# EAGLE design Senior_Design_Board (EAGLE 9.6.2)
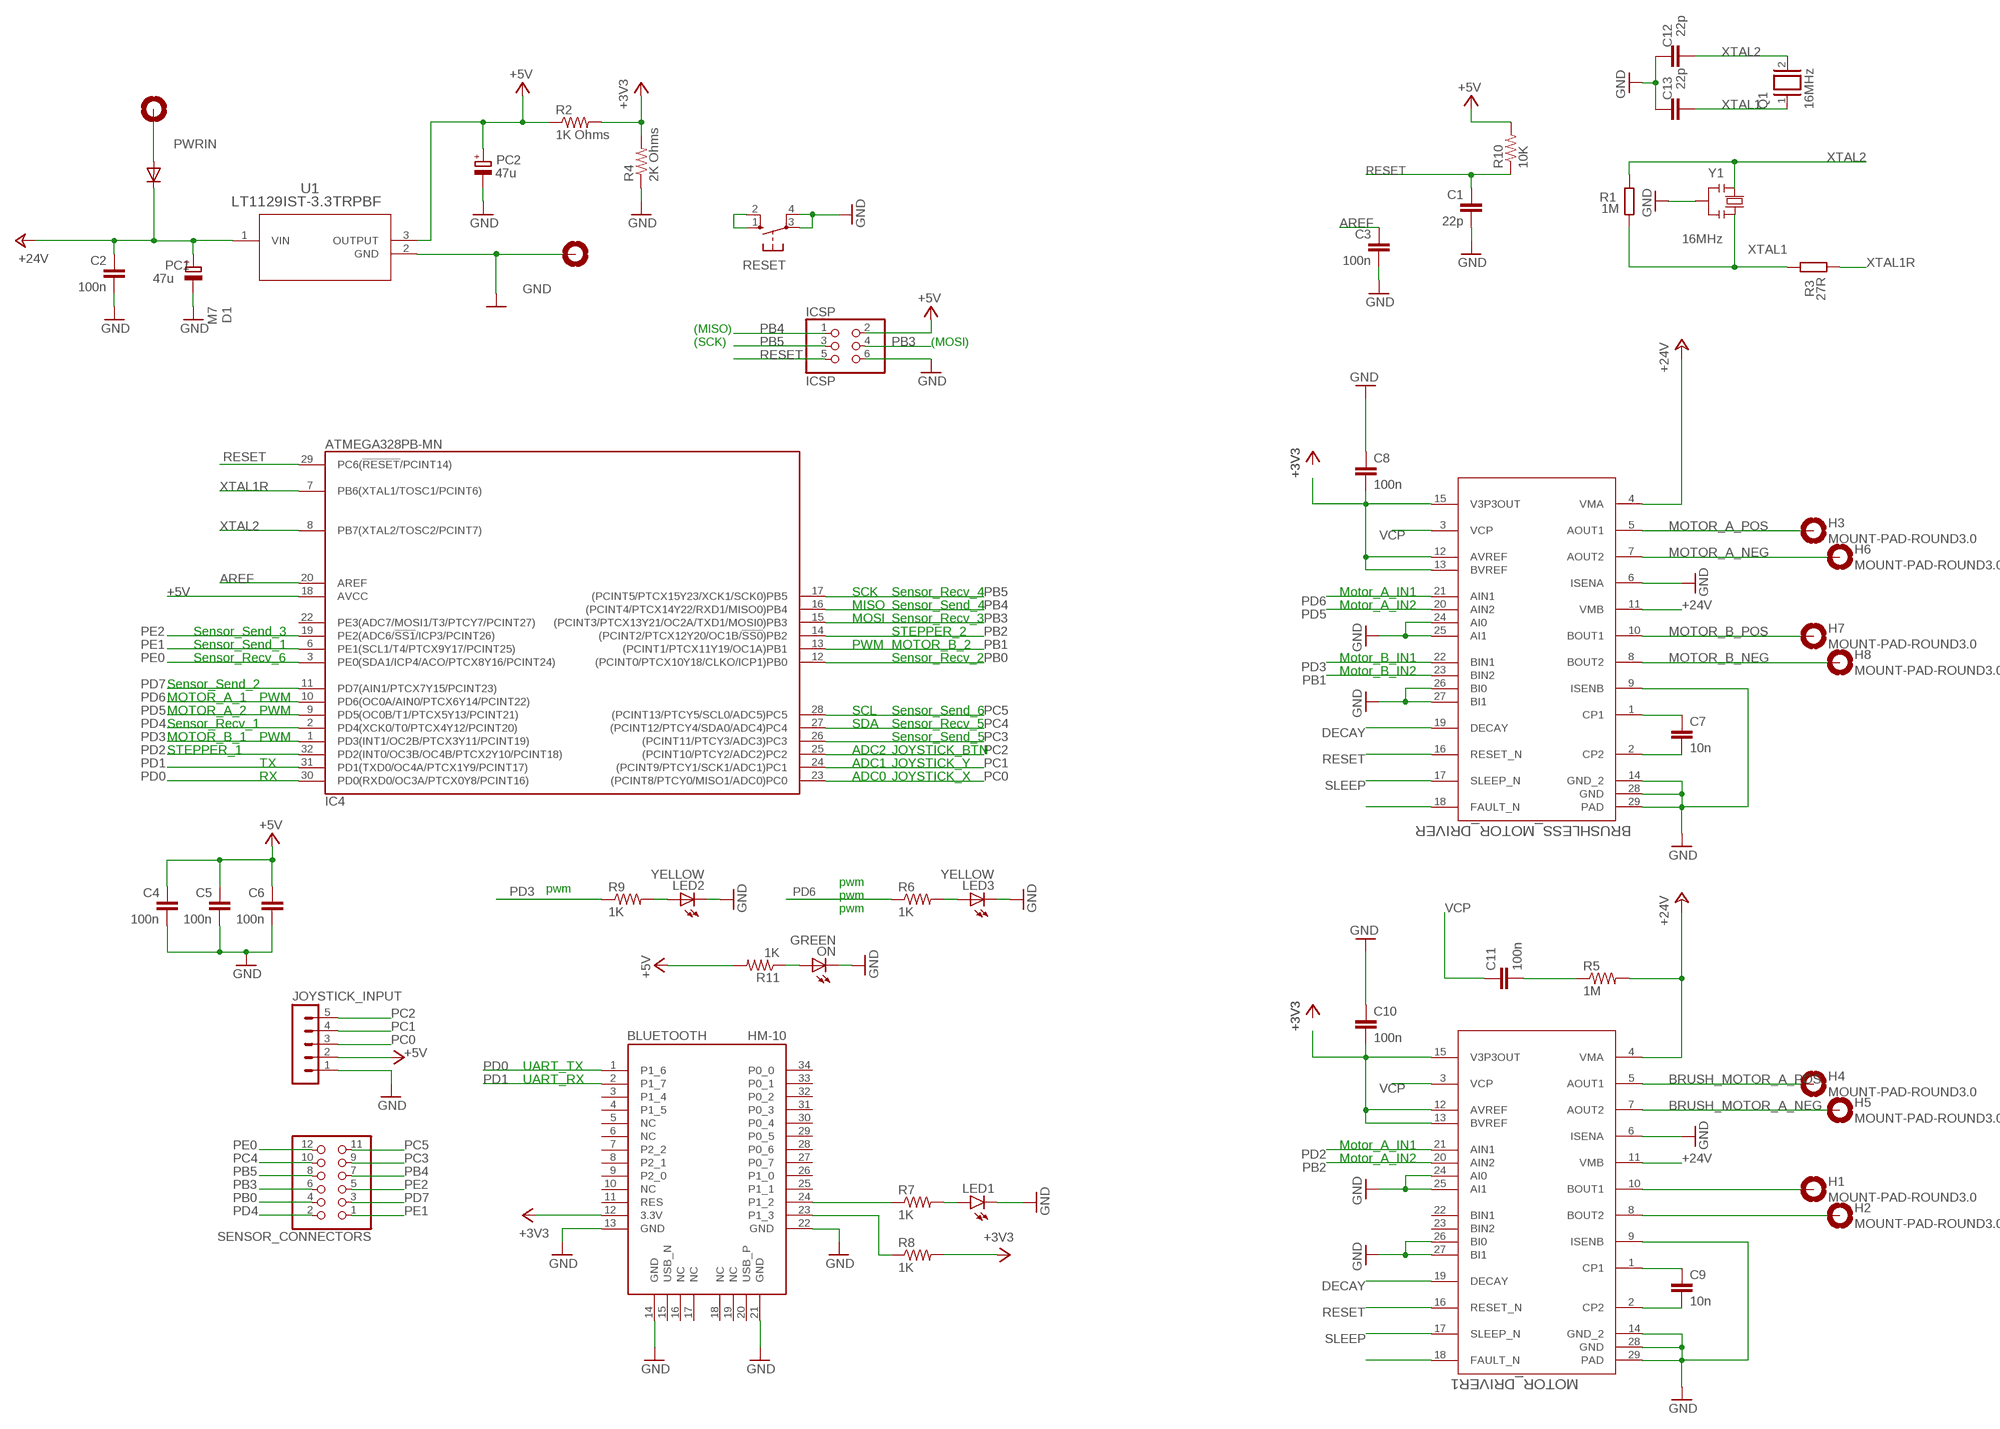
[diagram p0: schematic, sheet 1]

## Parts
BATTERY_NEG  MOUNT-PAD-ROUND3.0  [3,0-PAD]
BATTERY_POS  MOUNT-PAD-ROUND3.0  [3,0-PAD]
BLUETOOTH  HM-10  [HM-10]
BRUSHLESS_MOTOR_DRIVER  Value  DRV8841PWP  [PWP0028C_N]
C1  22p  C-EU0603-RND  [C0603-ROUND]
C2  100n  C-EU0603-RND  [C0603-ROUND]
C3  100n  C-EU0603-RND  [C0603-ROUND]
C4  100n  C-EU0603-RND  [C0603-ROUND]
C5  100n  C-EU0603-RND  [C0603-ROUND]
C6  100n  C-EU0603-RND  [C0603-ROUND]
C7  10n  C2,5-3  [C2.5-3]
C8  100n  C2,5-3  [C2.5-3]
C9  10n  C2,5-3  [C2.5-3]
C10  100n  C2,5-3  [C2.5-3]
C11  100n  C2,5-3  [C2.5-3]
C12  22p  C-EU0603-RND  [C0603-ROUND]
C13  22p  C-EU0603-RND  [C0603-ROUND]
D1  M7  DIODE-SMB  [SMB]
H1  MOUNT-PAD-ROUND3.0  [3,0-PAD]
H2  MOUNT-PAD-ROUND3.0  [3,0-PAD]
H3  MOUNT-PAD-ROUND3.0  [3,0-PAD]
H4  MOUNT-PAD-ROUND3.0  [3,0-PAD]
H5  MOUNT-PAD-ROUND3.0  [3,0-PAD]
H6  MOUNT-PAD-ROUND3.0  [3,0-PAD]
H7  MOUNT-PAD-ROUND3.0  [3,0-PAD]
H8  MOUNT-PAD-ROUND3.0  [3,0-PAD]
IC4  ATMEGA328PB-MN  [QFN32_5X5_0.50]
ICSP  ICSP  PINHD-2X3  [2X03]
JOYSTICK_INPUT  MA05-1  [MA05-1]
LED1  LEDCHIP-LED0805  [CHIP-LED0805]
LED2  YELLOW  LEDCHIP-LED0805  [CHIP-LED0805]
LED3  YELLOW  LEDCHIP-LED0805  [CHIP-LED0805]
MOTOR_DRIVER1  Value  DRV8841PWP  [PWP0028C_N]
ON  GREEN  LEDCHIP-LED0805  [CHIP-LED0805]
PC1  47u  CPOL-EUD  [PANASONIC_D]
PC2  47u  CPOL-EUD  [PANASONIC_D]
Q1  16MHz  XTAL/S  [QS]
R1  1M  R-EU_R0603  [R0603-ROUND]
R2  1K Ohms  R-US_0204/7  [0204/7]
R3  27R  R-EU_R0603  [R0603-ROUND]
R4  2K Ohms  R-US_0204/7  [0204/7]
R5  1M  R-US_0204/7  [0204/7]
R6  1K  R-US_M0805  [M0805]
R7  1K  R-US_0204/7  [0204/7]
R8  1K  R-US_0204/7  [0204/7]
R9  1K  R-US_M0805  [M0805]
R10  10K  R-US_M0805  [M0805]
R11  1K  R-US_M0805  [M0805]
RESET  10-XX  [B3F-10XX]
SENSOR_CONNECTORS  PINHD-2X6  [2X06]
U1  LT1129IST-3.3TRPBF  [SOT-223_ST_LIT]
Y1  16MHz  RESONATORMU  [RESONATOR]

## Nets
+3V3: BLUETOOTH.12(3.3V) R2.2 R4.2 R8.2
+5V: C4.1 C5.1 C6.1 IC4.18(AVCC) ICSP.2 JOYSTICK_INPUT.2 PC2.+ R2.1 R10.2 R11.2 U1.3(OUTPUT)
+24V: BRUSHLESS_MOTOR_DRIVER.4(VMA) BRUSHLESS_MOTOR_DRIVER.11(VMB) C2.1 D1.C MOTOR_DRIVER1.4(VMA) MOTOR_DRIVER1.11(VMB) PC1.+ R5.2 U1.1(VIN)
AREF: C3.1 IC4.20(AREF)
BRUSH_MOTOR_A_NEG: H5.B3,0(MOUNT) MOTOR_DRIVER1.7(AOUT2)
BRUSH_MOTOR_A_POS: H4.B3,0(MOUNT) MOTOR_DRIVER1.5(AOUT1)
DECAY: BRUSHLESS_MOTOR_DRIVER.19(DECAY) MOTOR_DRIVER1.19(DECAY)
DRIVER_FAULT: BRUSHLESS_MOTOR_DRIVER.18(FAULT_N)
DRIVER_FAULT1: MOTOR_DRIVER1.18(FAULT_N)
GND: BATTERY_POS.B3,0(MOUNT) BLUETOOTH.13(GND) BLUETOOTH.14(GND) BLUETOOTH.21(GND) BLUETOOTH.22(GND) BRUSHLESS_MOTOR_DRIVER.6(ISENA) BRUSHLESS_MOTOR_DRIVER.9(ISENB) BRUSHLESS_MOTOR_DRIVER.14(GND_2) BRUSHLESS_MOTOR_DRIVER.24(AI0) BRUSHLESS_MOTOR_DRIVER.25(AI1) BRUSHLESS_MOTOR_DRIVER.26(BI0) BRUSHLESS_MOTOR_DRIVER.27(BI1) BRUSHLESS_MOTOR_DRIVER.28(GND) BRUSHLESS_MOTOR_DRIVER.29(PAD) C1.2 C2.2 C3.2 C4.2 C5.2 C6.2 C8.1 C10.1 C12.2 C13.2 ICSP.6 JOYSTICK_INPUT.1 LED1.C LED2.C LED3.C MOTOR_DRIVER1.6(ISENA) MOTOR_DRIVER1.9(ISENB) MOTOR_DRIVER1.14(GND_2) MOTOR_DRIVER1.24(AI0) MOTOR_DRIVER1.25(AI1) MOTOR_DRIVER1.26(BI0) MOTOR_DRIVER1.27(BI1) MOTOR_DRIVER1.28(GND) MOTOR_DRIVER1.29(PAD) ON.C PC1.- PC2.- R4.1 RESET.3(P) RESET.4(P1) U1.2(GND) Y1.2
MOTOR_A_NEG: BRUSHLESS_MOTOR_DRIVER.7(AOUT2) H6.B3,0(MOUNT)
MOTOR_A_NEG1: H2.B3,0(MOUNT) MOTOR_DRIVER1.8(BOUT2)
MOTOR_A_POS: BRUSHLESS_MOTOR_DRIVER.5(AOUT1) H3.B3,0(MOUNT)
MOTOR_B_NEG: BRUSHLESS_MOTOR_DRIVER.8(BOUT2) H8.B3,0(MOUNT)
MOTOR_B_POS: BRUSHLESS_MOTOR_DRIVER.10(BOUT1) H7.B3,0(MOUNT)
N$2: LED2.A R9.2
N$3: ON.A R11.1
N$4: LED1.A R7.2
N$5: C9.1 MOTOR_DRIVER1.1(CP1)
N$6: BLUETOOTH.23(P1_3) R8.1
N$7: C9.2 MOTOR_DRIVER1.2(CP2)
N$8: C10.2 MOTOR_DRIVER1.12(AVREF) MOTOR_DRIVER1.13(BVREF) MOTOR_DRIVER1.15(V3P3OUT)
N$9: C11.2 R5.1
N$10: H1.B3,0(MOUNT) MOTOR_DRIVER1.10(BOUT1)
N$13: BRUSHLESS_MOTOR_DRIVER.1(CP1) C7.1
N$14: BRUSHLESS_MOTOR_DRIVER.2(CP2) C7.2
N$15: BRUSHLESS_MOTOR_DRIVER.12(AVREF) BRUSHLESS_MOTOR_DRIVER.13(BVREF) BRUSHLESS_MOTOR_DRIVER.15(V3P3OUT) C8.2
N$16: BLUETOOTH.24(P1_2) R7.1
PB0: IC4.12((PCINT0/PTCX10Y18/CLKO/ICP1)PB0) SENSOR_CONNECTORS.4
PB1: BRUSHLESS_MOTOR_DRIVER.23(BIN2) IC4.13((PCINT1/PTCX11Y19/OC1A)PB1)
PB2: IC4.14((PCINT2/PTCX12Y20/OC1B/!SS0!)PB2) MOTOR_DRIVER1.20(AIN2)
PB3: IC4.15((PCINT3/PTCX13Y21/OC2A/TXD1/MOSI0)PB3) ICSP.4 SENSOR_CONNECTORS.6
PB4: IC4.16((PCINT4/PTCX14Y22/RXD1/MISO0)PB4) ICSP.1 SENSOR_CONNECTORS.7
PB5: IC4.17((PCINT5/PTCX15Y23/XCK1/SCK0)PB5) ICSP.3 SENSOR_CONNECTORS.8
PC0: IC4.23((PCINT8/PTCY0/MISO1/ADC0)PC0) JOYSTICK_INPUT.3
PC1: IC4.24((PCINT9/PTCY1/SCK1/ADC1)PC1) JOYSTICK_INPUT.4
PC2: IC4.25((PCINT10/PTCY2/ADC2)PC2) JOYSTICK_INPUT.5
PC3: IC4.26((PCINT11/PTCY3/ADC3)PC3) SENSOR_CONNECTORS.9
PC4: IC4.27((PCINT12/PTCY4/SDA0/ADC4)PC4) SENSOR_CONNECTORS.10
PC5: IC4.28((PCINT13/PTCY5/SCL0/ADC5)PC5) SENSOR_CONNECTORS.11
PD0: BLUETOOTH.1(P1_6) IC4.30(PD0(RXD0/OC3A/PTCX0Y8/PCINT16))
PD1: BLUETOOTH.2(P1_7) IC4.31(PD1(TXD0/OC4A/PTCX1Y9/PCINT17))
PD2: IC4.32(PD2(INT0/OC3B/OC4B/PTCX2Y10/PCINT18)) MOTOR_DRIVER1.21(AIN1)
PD3: BRUSHLESS_MOTOR_DRIVER.22(BIN1) IC4.1(PD3(INT1/OC2B/PTCX3Y11/PCINT19)) R9.1
PD4: IC4.2(PD4(XCK0/T0/PTCX4Y12/PCINT20)) SENSOR_CONNECTORS.2
PD5: BRUSHLESS_MOTOR_DRIVER.20(AIN2) IC4.9(PD5(OC0B/T1/PTCX5Y13/PCINT21))
PD6: BRUSHLESS_MOTOR_DRIVER.21(AIN1) IC4.10(PD6(OC0A/AIN0/PTCX6Y14/PCINT22)) R6.1
PD7: IC4.11(PD7(AIN1/PTCX7Y15/PCINT23)) SENSOR_CONNECTORS.3
PE0: IC4.3(PE0(SDA1/ICP4/ACO/PTCX8Y16/PCINT24)) SENSOR_CONNECTORS.12
PE1: IC4.6(PE1(SCL1/T4/PTCX9Y17/PCINT25)) SENSOR_CONNECTORS.1
PE2: IC4.19(PE2(ADC6/!SS1!/ICP3/PCINT26)) SENSOR_CONNECTORS.5
PWRIN: BATTERY_NEG.B3,0(MOUNT) D1.A
RESET: BRUSHLESS_MOTOR_DRIVER.16(RESET_N) C1.1 IC4.29(PC6(!RESET!/PCINT14)) ICSP.5 MOTOR_DRIVER1.16(RESET_N) R10.1 RESET.1(S) RESET.2(S1)
SLEEP: BRUSHLESS_MOTOR_DRIVER.17(SLEEP_N) MOTOR_DRIVER1.17(SLEEP_N)
VCP: BRUSHLESS_MOTOR_DRIVER.3(VCP) C11.1 MOTOR_DRIVER1.3(VCP)
XTAL1: C13.1 Q1.1 R1.1 R3.2 Y1.3
XTAL1R: IC4.7(PB6(XTAL1/TOSC1/PCINT6)) R3.1
XTAL2: C12.1 IC4.8(PB7(XTAL2/TOSC2/PCINT7)) Q1.2 R1.2 Y1.1
Y_LED_POS: LED3.A R6.2
Unconnected: BLUETOOTH.3(P1_4) BLUETOOTH.4(P1_5) BLUETOOTH.5(NC) BLUETOOTH.6(NC) BLUETOOTH.7(P2_2) BLUETOOTH.8(P2_1) BLUETOOTH.9(P2_0) BLUETOOTH.10(NC) BLUETOOTH.11(RES) BLUETOOTH.15(USB_N) BLUETOOTH.16(NC) BLUETOOTH.17(NC) BLUETOOTH.18(NC) BLUETOOTH.19(NC) BLUETOOTH.20(USB_P) BLUETOOTH.25(P1_1) BLUETOOTH.26(P1_0) BLUETOOTH.27(P0_7) BLUETOOTH.28(P0_6) BLUETOOTH.29(P0_5) BLUETOOTH.30(P0_4) BLUETOOTH.31(P0_3) BLUETOOTH.32(P0_2) BLUETOOTH.33(P0_1) BLUETOOTH.34(P0_0) IC4.22(PE3(ADC7/MOSI1/T3/PTCY7/PCINT27)) MOTOR_DRIVER1.22(BIN1) MOTOR_DRIVER1.23(BIN2)

## Notes on the sheet
- (MISO)
- (SCK) | (MOSI)
- SCK | Sensor_Recv_4 | Motor_A_IN1
- MISO | Sensor_Send_4 | Motor_A_IN2
- MOSI | Sensor_Recv_3
- Sensor_Send_3 | STEPPER_2
- Sensor_Send_1 | PWM | MOTOR_B_2
- Sensor_Recv_6 | Sensor_Recv_2 | Motor_B_IN1
- Motor_B_IN2
- Sensor_Send_2
- MOTOR_A_1 | PWM
- MOTOR_A_2 | PWM | SCL | Sensor_Send_6
- Sensor_Recv_1 | SDA | Sensor_Recv_5
- MOTOR_B_1 | PWM | Sensor_Send_5
- STEPPER_1 | ADC2 | JOYSTICK_BTN
- TX | ADC1 | JOYSTICK_Y
- RX | ADC0 | JOYSTICK_X
- pwm
- pwm
- pwm
- pwm
- UART_TX
- UART_RX
- Motor_A_IN1
- Motor_A_IN2

## Power pins joined to a net without a drawn wire
GND: IC4.5(GND) IC4.21(GND) IC4.EXP(GND)
VCC: IC4.4(VCC)

## Library data of the parts
BATTERY_NEG BATTERY_POS H1-H8 = holes:MOUNT-PAD-ROUND: MOUNTING PAD, round
BLUETOOTH = HM-10_BLE:HM-10
BRUSHLESS_MOTOR_DRIVER MOTOR_DRIVER1 = DRV8841:DRV8841PWP; ALTERNATE_PARTNUMBER: DRV8841PWP; APPLICATION_BUILDNUMBER: *; COMPTYPE: IC; MANUFACTURER: Texas Instruments; MOUNTTYPE: SMT; PACKAGEREFERENCE: PWP0028C; PARTNUMBER: DRV8841PWPR; PIN_COUNT: 29; REFDES: RefDes; ROHS: Y; TYPE: TYPE
C1-C6 C12 C13 = SmartPrj:C-EU: CAPACITOR, European symbol
C7-C11 = capacitor-wima:C: CAPACITOR naming: grid - package width
D1 = diode:DIODE-: DIODE
IC4 = atmel:ATMEGA328PB: 8-bit AVR Microcontroller 32kbytes flash 2kbytes SRAM 1kbyte EEPROM USART 8-channel 10 bit ADC
ICSP = pinhead:PINHD-2X3: PIN HEADER
JOYSTICK_INPUT = con-lstb:MA05-1: PIN HEADER; OC_FARNELL: unknown; OC_NEWARK: unknown
LED1-LED3 ON = led:LED: LED OSRAM: - CHIPLED LG R971, LG N971, LY N971, LG Q971, LY Q971, LO R971, LY R971 LH N974, LH R974 LS Q976, LO Q976, LY Q976 LO Q996 - Hyper CHIPLED LW Q18S LB Q993, LB Q99A, LB R99A - SideLED LS A670, LO A670, LY A670, LG A670, LP A670 LB A673, LV A673, LT A673, LW A673 LH A674 LY A675 LS A676, LA A676, LO A676, LY A676, LW A676 LS A679, LY A679, LG A679 - Hyper Micro SIDELED® LS Y876, LA Y876, LO Y876, LY Y876 LT Y87S - SmartLED LW L88C, LW L88S LB L89C, LB L89S, LG L890 LS L89K, LO L89K, LY L89K LS L896, LA L896, LO L896, LY L896 - TOPLED LS T670, LO T670, LY T670, LG T670, LP T670 LSG T670, LSP T670, LSY T670, LOP T670, LYG T670 LG T671, LOG T671, LSG T671 LB T673, LV T673, LT T673, LW T673 LH T674 LS T676, LA T676, LO T676, LY T676, LB T676, LH T676, LSB T676, LW T676 LB T67C, LV T67C, LT T67C, LS T67K, LO T67K, LY T67K, LW E67C LS E67B, LA E67B, LO E67B, LY E67B, LB E67C, LV E67C, LT E67C LW T67C LS T679, LY T679, LG T679 LS T770, LO T770, LY T770, LG T770, LP T770 LB T773, LV T773, LT T773, LW T773 LH T774 LS E675, LA E675, LY E675, LS T675 LS T776, LA T776, LO T776, LY T776, LB T776 LHGB T686 LT T68C, LB T68C - Hyper Mini TOPLED® LB M676 - Mini TOPLED Santana® LG M470 LS M47K, LO M47K, LY M47K Source: http://www.osram.convergy.de LUXEON: - LUMILED® LXK2-PW12-R00, LXK2-PW12-S00, LXK2-PW14-U00, LXK2-PW14-V00 LXK2-PM12-R00, LXK2-PM12-S00, LXK2-PM14-U00 LXK2-PE12-Q00, LXK2-PE12-R00, LXK2-PE12-S00, LXK2-PE14-T00, LXK2-PE14-U00 LXK2-PB12-K00, LXK2-PB12-L00, LXK2-PB12-M00, LXK2-PB14-N00, LXK2-PB14-P00, LXK2-PB14-Q00 LXK2-PR12-L00, LXK2-PR12-M00, LXK2-PR14-Q00, LXK2-PR14-R00 LXK2-PD12-Q00, LXK2-PD12-R00, LXK2-PD12-S00 LXK2-PH12-R00, LXK2-PH12-S00 LXK2-PL12-P00, LXK2-PL12-Q00, LXK2-PL12-R00 Source: www.luxeon.com KINGBRIGHT: KA-3528ASYC Source: www.kingbright.com
PC1 PC2 = rcl:CPOL-EU: POLARIZED CAPACITOR, European symbol
Q1 = special:XTAL/S: CRYSTAL
R1 R3 = SmartPrj:R-EU_: RESISTOR, European symbol
R2 R4-R11 = rcl:R-US_: RESISTOR, American symbol; SPICEPREFIX: R
RESET = switch-omron:10-XX: OMRON SWITCH; MPN: B3F-1000; OC_FARNELL: 176432; OC_NEWARK: 36M3542
SENSOR_CONNECTORS = pinhead:PINHD-2X6: PIN HEADER
U1 = LT1129IST:LT1129IST-3.3TRPBF; BUILT_BY: EMA_UL_Team; MANUFACTURER_PART_NUMBER: LT1129IST-3.3#TRPBF; SOURCELIBRARY: LinearTech_2016-05-13_2; VENDOR: Linear Technology
Y1 = SmartPrj:RESONATOR

## Net classes
0 default: width 0.152 mm, drill 0.305 mm, clearance 0.152 mm

## Board
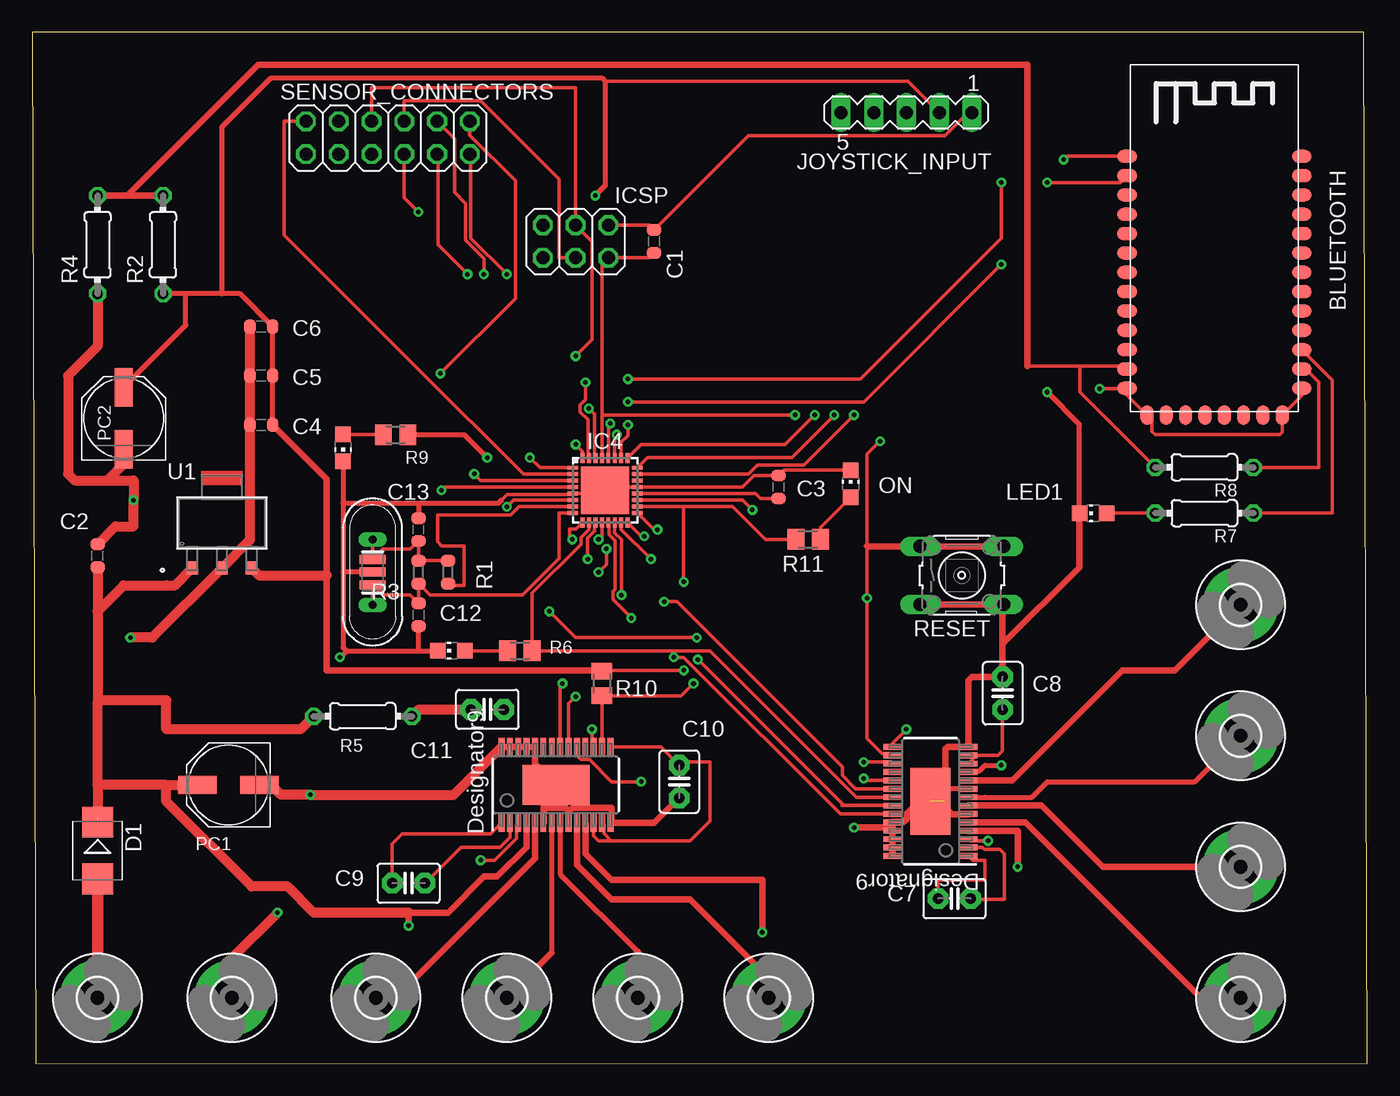
[diagram p1: board, top side]
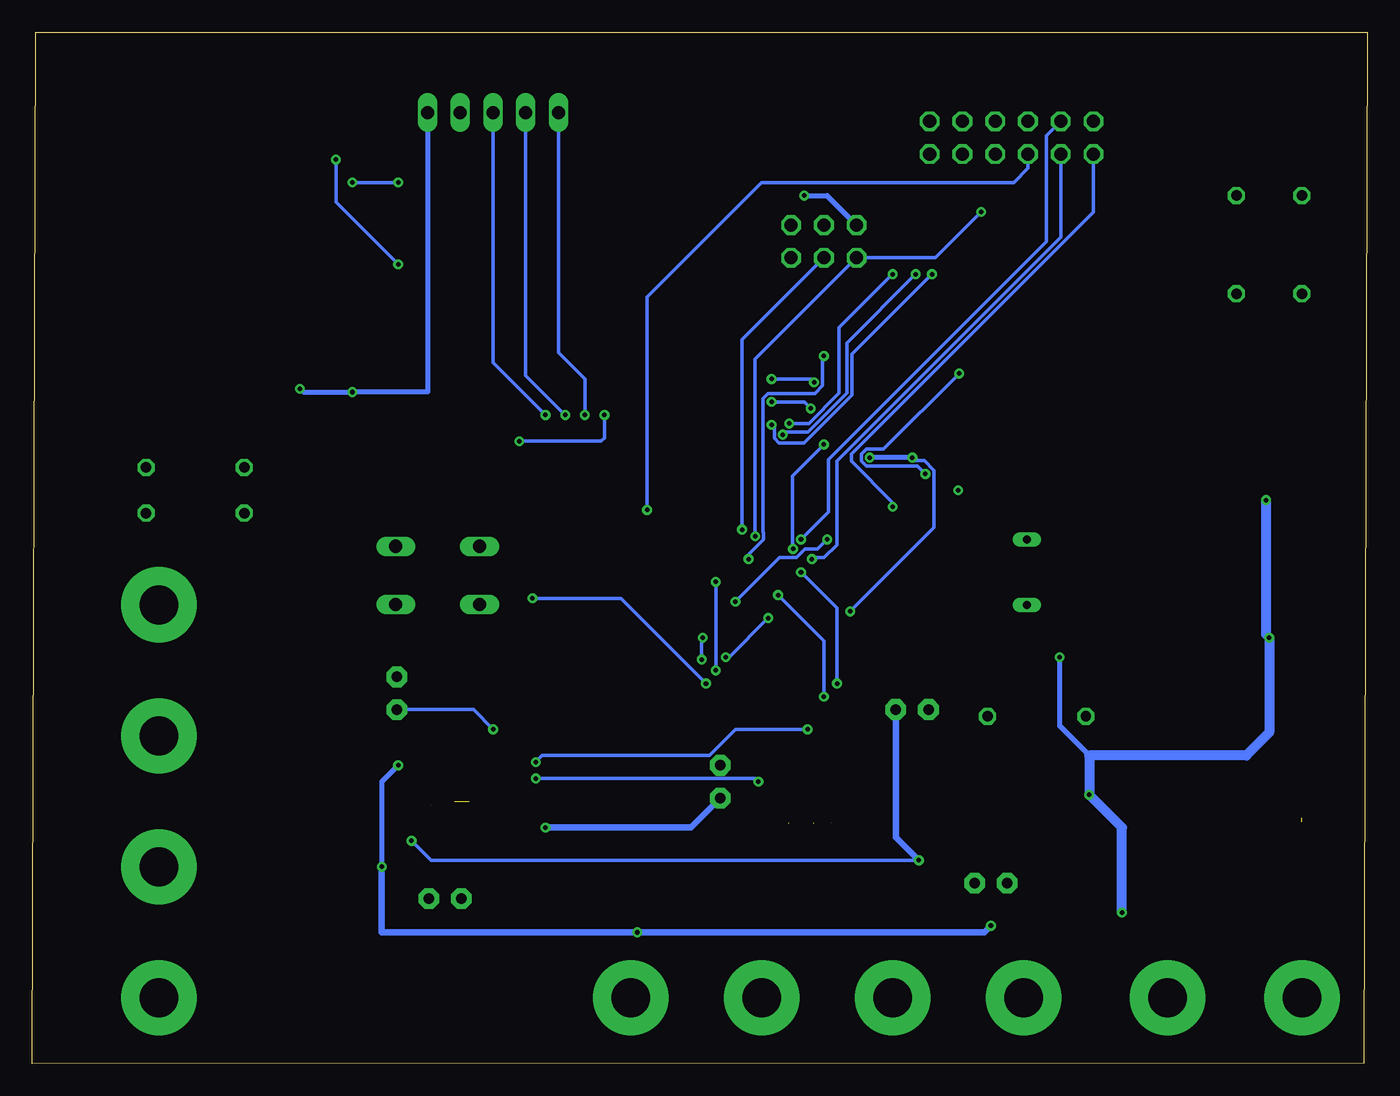
[diagram p2: board, bottom side, seen from below]

Size 103.55 x 80 mm. Coordinates in mm from the lower left corner, seen from the top.
Outline: 0.25,0.02 103.55,0 103.3,80 0,80 0.25,0.02
Copper layers (1*16): Top 0.035mm / dielectric 1.5mm / Bottom 0.035mm
Design rules "default": minimum track width 6mil, minimum drill 0.35mm, track to track 6mil, track to pad 6mil, pad to pad 6mil, via to via 6mil, smd to smd 6mil, copper to edge 40mil, drill to drill 6mil, minimum pad ring 10mil, minimum via ring 8mil, stop-mask expansion 4mil, vias tented up to drill 0mil, thermal gap 10mil

### Footprints (pad centres in the part's own frame; a part is rotated, then mirrored left to right if it is on the bottom)
3,0-PAD = drill 3 pad 5.842: B3,0 0,0
HM-10 = smd 1.5 x 1: 1 -6.77,6.35; 2 -6.77,4.85; 3 -6.77,3.35; 4 -6.77,1.85; 5 -6.77,0.35; 6 -6.77,-1.15; 7 -6.77,-2.65; 8 -6.77,-4.15; 9 -6.77,-5.65; 10 -6.77,-7.15; 11 -6.77,-8.65; 12 -6.77,-10.15; 13 -6.77,-11.65; 22 6.77,-11.65; 23 6.77,-10.15; 24 6.77,-8.65; 25 6.77,-7.15; 26 6.77,-5.65; 27 6.77,-4.15; 28 6.77,-2.65; 29 6.77,-1.15; 30 6.77,0.35; 31 6.77,1.85; 32 6.77,3.35; 33 6.77,4.85; 34 6.77,6.35 | smd 1 x 1.5: 14 -5.23,-13.72; 15 -3.73,-13.72; 16 -2.23,-13.72; 17 -0.73,-13.72; 18 0.77,-13.72; 19 2.27,-13.72; 20 3.77,-13.72; 21 5.27,-13.72
PWP0028C_N = smd 1.4 x 0.45: 1 -2.95,4.225; 2 -2.95,3.575; 3 -2.95,2.925; 4 -2.95,2.275; 5 -2.95,1.625; 6 -2.95,0.975; 7 -2.95,0.325; 8 -2.95,-0.325; 9 -2.95,-0.975; 10 -2.95,-1.625; 11 -2.95,-2.275; 12 -2.95,-2.925; 13 -2.95,-3.575; 14 -2.95,-4.225; 15 2.95,-4.225; 16 2.95,-3.575; 17 2.95,-2.925; 18 2.95,-2.275; 19 2.95,-1.625; 20 2.95,-0.975; 21 2.95,-0.325; 22 2.95,0.325; 23 2.95,0.975; 24 2.95,1.625; 25 2.95,2.275; 26 2.95,2.925; 27 2.95,3.575; 28 2.95,4.225 | smd 3.1 x 5.18: 29 0,0 | smd 0.5 x 0.5: V 0,0
C0603-ROUND = smd 0.898 x 1.1: 1 -0.889,0; 2 0.889,0
C2.5-3 = drill 0.813 pad 1.6 octagon: 1 -1.27,0; 2 1.27,0
SMB = smd 2.4 x 2.4: A 2.2,0; C -2.2,0
QFN32_5X5_0.50 = smd 0.8 x 0.3: 1 -2.5,1.75; 2 -2.5,1.25; 3 -2.5,0.75; 4 -2.5,0.25; 5 -2.5,-0.25; 6 -2.5,-0.75; 7 -2.5,-1.25; 8 -2.5,-1.75; 17 2.5,-1.75; 18 2.5,-1.25; 19 2.5,-0.75; 20 2.5,-0.25; 21 2.5,0.25; 22 2.5,0.75; 23 2.5,1.25; 24 2.5,1.75 | smd 0.3 x 0.8: 9 -1.75,-2.5; 10 -1.25,-2.5; 11 -0.75,-2.5; 12 -0.25,-2.5; 13 0.25,-2.5; 14 0.75,-2.5; 15 1.25,-2.5; 16 1.75,-2.5; 25 1.75,2.5; 26 1.25,2.5; 27 0.75,2.5; 28 0.25,2.5; 29 -0.25,2.5; 30 -0.75,2.5; 31 -1.25,2.5; 32 -1.75,2.5 | smd 3.7 x 3.7: EXP 0,0
2X03 = drill 1.016 octagon: 1 -2.54,-1.27; 2 -2.54,1.27; 3 0,-1.27; 4 0,1.27; 5 2.54,-1.27; 6 2.54,1.27
MA05-1 = drill 1.016 long: 1 -5.08,0; 2 -2.54,0; 3 0,0; 4 2.54,0; 5 5.08,0
CHIP-LED0805 = smd 1.2 x 1.2: A 0,-1.05; C 0,1.05
PANASONIC_D = smd 3 x 1.4: + 2.4,0; - -2.4,0
QS = drill 0.61 long: 1 -2.54,0; 2 2.54,0
R0603-ROUND = smd 0.898 x 1.1: 1 -0.889,0; 2 0.889,0
0204/7 = drill 0.813 octagon: 1 -3.81,0; 2 3.81,0
M0805 = smd 1.3 x 1.6: 1 -0.95,0; 2 0.95,0
B3F-10XX = drill 1.016 long: 1 -3.251,2.261; 2 3.251,2.261; 3 -3.251,-2.261; 4 3.251,-2.261
2X06 = drill 1.016 octagon: 1 -6.35,-1.27; 2 -6.35,1.27; 3 -3.81,-1.27; 4 -3.81,1.27; 5 -1.27,-1.27; 6 -1.27,1.27; 7 1.27,-1.27; 8 1.27,1.27; 9 3.81,-1.27; 10 3.81,1.27; 11 6.35,-1.27; 12 6.35,1.27
SOT-223_ST_LIT = smd 0.889 x 1.016: 1 -2.299,-3.493; 2 0,-3.493; 3 2.299,-3.493
RESONATOR = smd 0.7 x 2: 1 -1,0; 2 0,0; 3 1,0

### Placement (x,y rotation side)
BATTERY_NEG  5.06,5.1 0 top
BATTERY_POS  15.48,5.1 0 top
BLUETOOTH  91.69,64.03 0 top
BRUSHLESS_MOTOR_DRIVER  69.67,20.34 180 top
C1  48.24,63.77 90 top
C2  5.06,39.39 90 top
C3  57.9,44.72 90 top
C4  17.76,49.55 180 top
C5  17.76,53.36 180 top
C6  17.76,57.17 180 top
C7  71.53,12.8 0 top
C8  75.26,28.72 270 top
C9  29.19,13.99 0 top
C10  50.18,21.86 90 top
C11  35.31,27.47 180 top
C12  29.96,34.82 270 top
C13  29.96,41.42 90 top
D1  5.06,16.53 270 top
H1  57.13,5.1 0 top
H2  46.97,5.1 0 top
H3  93.72,5.1 0 top
H4  26.65,5.1 0 top
H5  36.81,5.1 0 top
H6  93.72,15.26 0 top
H7  93.72,35.58 0 top
H8  93.72,25.42 0 top
IC4  44.43,44.47 0 top
ICSP  42.15,63.77 0 top
JOYSTICK_INPUT  67.82,73.77 180 top
LED1  82.28,42.69 90 top
LED2  24.11,47.77 180 top
LED3  32.5,32.02 90 top
MOTOR_DRIVER1  40.62,21.61 90 top
ON  63.48,44.98 0 top
PC1  15.22,21.61 180 top
PC2  7.1,50.06 90 top
Q1  26.4,38.12 270 top
R1  29.96,38.12 270 top
R2  10.14,63.52 90 top
R3  32.24,38.12 90 top
R4  5.06,63.52 90 top
R5  25.64,26.94 180 top
R6  37.83,32.02 180 top
R7  90.92,42.69 180 top
R8  90.92,46.25 180 top
R9  28.18,48.79 180 top
R10  44.18,29.48 90 top
R11  60.18,40.66 180 top
RESET  72.11,37.87 0 top
SENSOR_CONNECTORS  27.59,71.82 0 top
U1  14.72,41.93 0 top
Y1  26.4,38.12 90 top

### Tracks (layer width: path | path; a pad name or v marks a point on that pad's centre or on a via)
+3V3
  Top 0.254: R8.2 81.26,52.09 81.26,54.12 | 77.2,54.12 81.26,54.12 | 81.26,54.12 84.68,54.12 BLUETOOTH.12
  Top 0.508: R4.2 7.35,67.33 | 7.35,67.33 R2.2 | 7.35,67.33 17.51,77.49 77.2,77.49 77.2,54.12
+5V  (via drill 0.35)
  Top 0.254: IC4.18 50.53,43.22 | 50.53,43.22 54.32,43.22 56.88,40.66 R11.2 | JOYSTICK_INPUT.2 67.91,76.22 44.43,76.22 | 50.53,43.22 v50.53,37.36 | R10.2 44.25,30.5 v50.53,30.5
  Top 0.381: C4.1 C5.1 C6.1 16.11,59.71 14.72,59.71 | 14.72,59.71 11.92,59.71 | 11.92,59.71 R2.1 | PC2.+ 11.92,57.28 11.92,59.71 | 14.72,59.71 14.72,72.66 18.53,76.47 44.18,76.47 44.43,76.22 44.43,68.09 v43.67,67.33
  Top 0.508: C4.1 22.84,45.36 22.84,37.87 22.84,30.5 44.11,30.5 R10.2
  Top 0.762: U1.3 17.59,37.87 22.84,37.87
  Bottom 0.254: v50.53,30.5 v50.53,37.36
  Bottom 0.381: v43.67,67.33 41.89,67.33 ICSP.2
+24V  (via drill 0.35)  (2 unrouted)
  Top 0.152: 10.41,37.09 10.16,36.85 10.14,36.85
  Top 0.381: BRUSHLESS_MOTOR_DRIVER.11 72.71,22.7 73.47,22.7 73.9,23.13 v75.17,23.13
  Top 0.508: 5.06,27.96 5.29,28.19 | MOTOR_DRIVER1.4 38.33,18.64 38.33,16.78 36.06,14.51 35.04,14.51 32.24,11.7 29.19,11.7 v29.19,10.69 | v76.44,15.26 76.44,18.07 BRUSHLESS_MOTOR_DRIVER.4 | 42.91,18.65 42.91,16.28 44.94,14.24 56.63,14.24 v56.63,10.18
  Top 0.762: 5.06,21.61 5.06,19.07 | 10.4,21.61 5.06,21.61 | 5.06,21.61 5.06,27.96 5.06,35.07 | 5.29,28.19 10.4,28.19 10.4,25.93 20.81,25.93 R5.2 | 5.06,35.07 7.09,37.09 10.41,37.09 11.07,37.09 U1.1 | 10.4,21.61 10.4,20.34 17,13.74 19.8,13.74 21.83,11.7 29.19,11.7 | 10.4,21.61 PC1.+ | C2.1 5.06,35.07
  Bottom 0.381: v75.17,23.13 76.44,21.86 v76.44,15.26
  Bottom 0.508: v29.19,10.69 29.7,10.18 v56.63,10.18 76.44,10.18 v76.44,15.26
AREF
  Top 0.254: IC4.20 56.11,44.22 56.5,43.84 C3.1
BRUSH_MOTOR_A_NEG
  Top 0.381: MOTOR_DRIVER1.7 40.3,8.58
  Top 0.508: 40.3,8.58 H5.B3,0
BRUSH_MOTOR_A_POS
  Top 0.508: MOTOR_DRIVER1.5 39,15.92 28.18,5.1 H4.B3,0
DECAY  (via drill 0.35)
  Top 0.254: v47.23,21.86 44.95,21.86 43.23,23.58 42.56,23.58 42.39,23.74 42.39,24.41 MOTOR_DRIVER1.19 | BRUSHLESS_MOTOR_DRIVER.19 64.65,21.96 v64.5,22.12
  Bottom 0.254: v64.5,22.12 47.48,22.12 v47.23,21.86
GND  (via drill 0.35)  (3 unrouted)
  Top 0.152: 18.53,21.61 PC1.- | IC4.EXP 44.31,44.34
  Top 0.254: LED2.C 24,46.61 | 6.84,47.4 PC2.- | 36.39,43.71 36.83,44.15 41.86,44.15 IC4.5 44.18,44.22 44.31,44.34 44.68,44.72 IC4.21 55.1,44.72 55.99,45.61 C3.2 58.31,46.03 ON.C | ICSP.6 47.86,65.04 C1.2 55.55,71.97 70.79,71.97 72.59,73.77 JOYSTICK_INPUT.1 | BLUETOOTH.22 98.46,51.81 BLUETOOTH.21 96.96,48.99 96.76,48.79 87.11,48.79 86.85,49.04 86.85,49.92 BLUETOOTH.14 84.92,51.85 BLUETOOTH.13 84.89,52.34 v82.79,52.34
  Top 0.381: BRUSHLESS_MOTOR_DRIVER.9 71.05,21.32 70.85,21.52 | LED1.C 81.23,49.58 v78.72,52.09 | v23.86,31.52 24.37,32.02 | 24.37,32.02 29.96,32.02 | 29.96,32.02 LED3.C | 29.96,32.02 C12.2 | LED2.C 24.11,43.45 | 24.11,43.45 24.11,38.12 | 24.11,38.12 24.11,32.28 24.37,32.02 | 36.39,43.71 36.14,43.45 29.96,43.45 | 29.96,43.45 C13.2 | 29.96,43.45 24.11,43.45 | Y1.2 24.11,38.12
  Top 0.508: BATTERY_POS.B3,0 15.48,8.15 | v21.57,20.85 21.86,20.85 | 36.24,24.4 MOTOR_DRIVER1.28 MOTOR_DRIVER1.27 MOTOR_DRIVER1.26 MOTOR_DRIVER1.25 MOTOR_DRIVER1.24 | C10.1 48.25,18.66 MOTOR_DRIVER1.14 | v63.74,18.31 66.32,18.31 BRUSHLESS_MOTOR_DRIVER.24 | BRUSHLESS_MOTOR_DRIVER.24 BRUSHLESS_MOTOR_DRIVER.25 BRUSHLESS_MOTOR_DRIVER.26 BRUSHLESS_MOTOR_DRIVER.27 BRUSHLESS_MOTOR_DRIVER.28 | BRUSHLESS_MOTOR_DRIVER.24 66.74,18.73 67.59,18.73 67.83,18.97 67.83,19.43 69.4,21 69.95,21 70.33,20.61 70.33,20.34 70.8,20.34 | BRUSHLESS_MOTOR_DRIVER.6 72.61,19.35 71.76,19.35 71.73,19.32 71.36,19.32 70.34,20.34 BRUSHLESS_MOTOR_DRIVER.29 70.85,21.52 70.85,24.4 71.01,24.57 BRUSHLESS_MOTOR_DRIVER.14 72.62,29.73 72.88,29.99 C8.1 75.26,32.53 | 75.26,32.53 75.26,35.51 RESET.4 RESET.3 | MOTOR_DRIVER1.24 39.02,24.54 | MOTOR_DRIVER1.9 41.59,19.63 41.39,19.83 39.86,19.83 39.65,19.62 MOTOR_DRIVER1.6 39.65,20.63 MOTOR_DRIVER1.29 39,23.23 MOTOR_DRIVER1.24 | MOTOR_DRIVER1.9 41.6,19.54 41.89,19.83 44.94,19.83 44.94,18.75 44.88,18.69 44.88,18.66 | 75.26,32.53 81.23,38.5 LED1.C
  Top 0.762: 15.48,8.15 v19.03,11.7 | 18.53,21.61 19.29,20.85 v21.57,20.85 32.69,20.85 36.24,24.4 | C2.2 6.46,41.67 7.86,41.67 v7.86,43.71 7.86,45.23 5.83,45.23 | R4.1 5.06,55.65 2.78,53.36 2.78,45.74 3.29,45.23 5.83,45.23 | C6.2 C5.2 C4.2 16.88,40.6 U1.2 9.32,33.04 v7.6,33.04 | PC2.- 7.1,46.5 5.83,45.23
  Bottom 0.254: 7.86,33.29 v7.6,33.04 | v82.79,52.34 82.53,52.09
  Bottom 0.381: 82.53,52.09 v78.72,52.09 72.88,52.09 72.88,73.76 JOYSTICK_INPUT.1 | 21.57,23.9 23.86,26.18 v23.86,31.52
  Bottom 0.508: C10.1 52.47,18.31 v63.74,18.31
  Bottom 0.762: v19.03,11.7 19.03,18.31 v21.57,20.85 21.57,23.9 9.38,23.9 7.6,25.67 v7.6,33.04 | v7.86,43.71 7.86,33.29
MOTOR_A_NEG  (1 unrouted)
  Top 0.508: H6.B3,0 83.04,15.26 78.28,20.02 BRUSHLESS_MOTOR_DRIVER.7 72.62,20.03
MOTOR_A_NEG1
  Top 0.381: MOTOR_DRIVER1.8 40.95,14.68 46.97,8.66
  Top 0.508: 46.97,8.66 H2.B3,0
MOTOR_A_POS
  Top 0.508: BRUSHLESS_MOTOR_DRIVER.5 77.05,18.71 90.66,5.1 H3.B3,0
MOTOR_B_NEG
  Top 0.381: BRUSHLESS_MOTOR_DRIVER.8 73.9,20.66 77.53,20.66 78.72,21.86 90.17,21.86 H8.B3,0
MOTOR_B_POS
  Top 0.508: BRUSHLESS_MOTOR_DRIVER.10 76.03,21.96 84.57,30.5 88.64,30.5 H7.B3,0
N$2
  Top 0.254: R9.2 24.15,48.79 LED2.A
N$3
  Top 0.254: ON.A 61.13,41.58 R11.1
N$4
  Top 0.254: R7.2 LED1.A
N$5
  Top 0.254: MOTOR_DRIVER1.1 35.54,17.8 28.69,17.8 27.92,17.04 C9.1
N$6
  Top 0.254: BLUETOOTH.23 98.78,53.88 99.81,52.85 99.81,46.25 R8.1
N$7
  Top 0.254: C9.2 33.26,16.78 36.31,16.78 37.05,17.53 MOTOR_DRIVER1.2
N$8
  Top 0.254: MOTOR_DRIVER1.15 48.76,24.56 C10.2 50.44,23.39 52.56,23.39 52.56,18.82 51.04,17.29 44.9,17.29 | MOTOR_DRIVER1.13 44.34,18.51 44.34,17.84 44.9,17.29 | MOTOR_DRIVER1.12 43.55,17.67 43.93,17.29 44.9,17.29
N$9
  Top 0.762: R5.1 29.97,27.47 C11.2
N$10
  Top 0.508: MOTOR_DRIVER1.10 42.25,15.41 44.94,12.72 51.04,12.72 57.13,6.62 H1.B3,0
N$13
  Top 0.152: 72.67,16.16 BRUSHLESS_MOTOR_DRIVER.1
  Top 0.254: BRUSHLESS_MOTOR_DRIVER.1 72.97,15.77 73.9,15.77 73.9,14.24 70.34,14.24 70.26,14.16 C7.1
N$14
  Top 0.254: BRUSHLESS_MOTOR_DRIVER.2 73.72,16.77 73.86,16.62 75.08,16.62 75.42,16.28 75.42,12.72 72.88,12.72 C7.2
N$15  (via drill 0.35)
  Top 0.254: C8.2 75.26,24.24 74.91,23.9 73.26,23.9 | 73.26,23.9 72.64,23.9 BRUSHLESS_MOTOR_DRIVER.13 | BRUSHLESS_MOTOR_DRIVER.12 73.26,23.9 | BRUSHLESS_MOTOR_DRIVER.15 66.72,24.85 v67.8,25.93
  Bottom 0.254: v67.8,25.93 69.33,27.45 C8.2
N$16
  Top 0.254: BLUETOOTH.24 100.82,53.02 100.82,42.69 R7.1
PB0  (via drill 0.35)
  Top 0.254: IC4.12 44.18,40.92 v43.93,40.66
  Bottom 0.254: SENSOR_CONNECTORS.4 24.88,72 24.88,63.77 41.8,46.85 41.8,42.78 v43.93,40.66
PB1  (via drill 0.35)
  Top 0.254: IC4.13 44.75,41.9 44.75,41.02 45.2,40.58 45.2,36.76 45.05,36.61 45.05,35.98 v46.47,34.56 | BRUSHLESS_MOTOR_DRIVER.23 62.68,19.36 50.53,31.52 v49.77,31.52
  Bottom 0.254: v46.47,34.56 49.51,31.52 v49.77,31.52
PB2  (via drill 0.35)
  Top 0.254: MOTOR_DRIVER1.20 41.6,27.92 v42.15,28.47 | v45.7,36.34 45.7,40.65 45.18,41.17 IC4.14
  Bottom 0.254: v42.15,28.47 42.15,32.79 v45.7,36.34
PB3  (via drill 0.35)
  Top 0.254: SENSOR_CONNECTORS.6 26.32,75.71 42.15,75.71 ICSP.4 43.42,63.77 43.42,56.15 v42.15,54.88 | v47.99,39.14 45.68,41.44 IC4.15
  Bottom 0.254: v47.99,39.14 47.99,39.48 46.82,40.64 46.82,41.19 46.87,41.23 46.87,51.6 46.48,51.99 42.85,51.99 42.25,52.58 42.25,54.78 v42.15,54.88
PB4  (via drill 0.35)
  Top 0.254: IC4.16 47.24,40.91 v47.48,40.91 | SENSOR_CONNECTORS.7 28.86,67.16 v29.96,66.06
  Bottom 0.254: v47.48,40.91 47.48,54.63 ICSP.1 33.51,62.5 v29.96,66.06
PB5  (via drill 0.35)
  Top 0.254: IC4.17 48.23,41.42 v48.5,41.42 | SENSOR_CONNECTORS.8 28.86,74.7 34.78,74.7 40.88,68.6 40.88,62.5 ICSP.3
  Bottom 0.254: ICSP.3 48.5,56.15 v48.5,41.42
PC0  (via drill 0.35)
  Top 0.254: IC4.23 46.95,45.74 55.54,45.74 56.24,46.43 59.86,46.43 v63.74,50.31
  Bottom 0.254: v63.74,50.31 67.82,54.39 JOYSTICK_INPUT.3
PC1  (via drill 0.35)
  Top 0.254: IC4.24 47.72,47.01 58.91,47.01 v62.21,50.31
  Bottom 0.254: v62.21,50.31 65.28,53.37 JOYSTICK_INPUT.4
PC2  (via drill 0.35)
  Top 0.254: IC4.25 47.24,48.03 58.4,48.03 v60.69,50.31
  Bottom 0.254: v60.69,50.31 60.69,53.11 62.74,55.15 JOYSTICK_INPUT.5
PC3  (via drill 0.35)
  Top 0.254: SENSOR_CONNECTORS.9 31.48,70.47 31.48,63.52 v33.77,61.23 | v46.21,49.55 46.21,48.73 45.68,48.2 IC4.26
  Bottom 0.254: v33.77,61.23 39.96,55.04 39.96,51.86 43.69,48.13 45.61,48.13 46,48.52 46,49.34 v46.21,49.55
PC4  (via drill 0.35)
  Top 0.254: IC4.27 45.18,48.63 v45.34,48.79 | v35.04,61.23 35.04,62.44 33.61,63.86 33.61,66.72 32.75,67.58 32.75,71.74 SENSOR_CONNECTORS.10
  Bottom 0.254: v45.34,48.79 45.13,49 43.4,49 40.37,52.03 40.37,55.9 v35.04,61.23
PC5  (via drill 0.35)
  Top 0.254: SENSOR_CONNECTORS.11 34.02,70.47 34.02,64.03 v36.81,61.23 | IC4.28 44.68,49.5 v44.84,49.65
  Bottom 0.254: v44.84,49.65 43.32,49.65 40.96,52.01 40.96,57.09 v36.81,61.23
PD0  (via drill 0.35)
  Top 0.254: IC4.30 43.61,47.04 43.61,50.37 v43.16,50.82 | v46.21,51.33 64.5,51.33 v75.17,62 | v79.99,70.12 80.25,70.38 BLUETOOTH.1
  Bottom 0.254: v43.16,50.82 43.67,51.33 v46.21,51.33 | v75.17,62 79.99,66.82 v79.99,70.12
PD1  (via drill 0.35)
  Top 0.152: IC4.31 43.16,46.99
  Top 0.254: IC4.31 43.11,47.04 43.11,49.94 42.51,50.55 42.51,51.09 42.91,51.5 v42.91,52.85 | v46.21,53.11 64.25,53.11 75.17,64.03 v75.17,68.35 | v78.72,68.35 84.39,68.35 BLUETOOTH.2
  Bottom 0.254: v42.91,52.85 43.16,53.11 v46.21,53.11 | v75.17,68.35 v78.72,68.35
PD2  (via drill 0.35)
  Top 0.254: MOTOR_DRIVER1.21 40.95,29.3 v41.13,29.48 | v43.93,38.12 44.54,38.73 v44.54,39.92 | v42.15,48.03 42.68,47.49 IC4.32
  Bottom 0.254: v41.13,29.48 41.13,35.33 v43.93,38.12 | v44.54,39.92 44.54,40.34 44.58,40.39 44.58,45.59 v42.15,48.03
PD3  (via drill 0.35)
  Top 0.254: IC4.1 39.38,46.22 v38.59,47.01 | BRUSHLESS_MOTOR_DRIVER.22 62.79,20.02 62.79,20.18 v51.63,31.35 | v40.12,35.07 42.15,33.04 v51.55,33.04
  Top 0.381: R9.1 33.51,48.79 v35.29,47.01
  Bottom 0.254: v35.29,47.01 35.04,46.76 34.36,46.76 33.62,46.01 33.62,41.57 v40.12,35.07 | v51.55,33.04 51.63,32.96 v51.63,31.35
  Bottom 0.381: v35.29,47.01 v38.59,47.01
PD4
  Top 0.254: IC4.2 38.1,45.72 29.83,54 19.54,64.28 19.54,73.09 SENSOR_CONNECTORS.2
PD5  (via drill 0.35)
  Top 0.254: IC4.9 42.16,41.45 41.67,41.45 41.67,40.66 v41.89,40.66 | BRUSHLESS_MOTOR_DRIVER.20 63.86,21.32 62.83,22.35 62.83,23.03 50.02,35.83 v49.01,35.83
  Bottom 0.254: v41.89,40.66 42.66,39.9 43.63,39.9 44.27,39.26 45.58,39.26 v49.01,35.83
PD6
  Top 0.254: 39.03,32.02 R6.1 | BRUSHLESS_MOTOR_DRIVER.21 63.92,20.66 52.56,32.02 R6.1 | IC4.10 43.18,41.44 42.55,40.81 42.55,40.27 38.78,36.5 R6.1
PD7  (via drill 0.35)
  Top 0.254: v43.08,39.14 43.08,40.76 43.61,41.3 43.61,41.9 IC4.11
  Bottom 0.254: v43.08,39.14 42.97,39.24 42.13,39.24 41.13,40.24 41.13,46.76 23.78,64.11 SENSOR_CONNECTORS.3
PE0  (via drill 0.35)
  Top 0.254: IC4.3 34.79,45.22 v34.27,45.74 | SENSOR_CONNECTORS.12 33.94,72.02 37.47,68.49 37.47,59.35 v31.65,53.53
  Bottom 0.254: v31.65,53.53 37.51,47.67 38.86,47.67 39.25,47.28 39.25,46.74 38.86,46.35 34.89,46.35 v34.27,45.74
PE1  (via drill 0.35)
  Top 0.254: IC4.6 37.33,43.72 v36.81,43.2
  Bottom 0.254: v36.81,43.2 36.81,43.54 40.01,46.74 40.01,47.28 21.24,66.05 SENSOR_CONNECTORS.1
PE2  (via drill 0.35)
  Top 0.254: IC4.19 55.09,43.72 v55.86,42.95
  Bottom 0.254: v55.86,42.95 55.86,59.46 46.97,68.35 27.42,68.35 26.32,69.44 SENSOR_CONNECTORS.5
PWRIN
  Top 0.889: D1.A BATTERY_NEG.B3,0
RESET  (via drill 0.35)
  Top 0.254: MOTOR_DRIVER1.16 44.2,28.52 R10.1 50.34,28.53 v51.29,29.48 | C1.1 47.86,62.5 ICSP.5 44.18,62 44.18,50.31 | IC4.29 44.18,50.31 | BRUSHLESS_MOTOR_DRIVER.16 66.58,24.06 65.91,24.06 64.75,25.21 v64.75,36.09 64.75,40.15 64.75,47.26 v65.77,48.28 | v59.17,50.31 44.18,50.31
  Top 0.508: 64.75,40.15 64.78,40.13 RESET.1 RESET.2
  Bottom 0.254: v65.77,48.28 59.42,48.28 59.17,48.53 v59.17,50.31 | v51.29,29.48 57.9,36.09 v64.75,36.09
SLEEP  (via drill 0.35)
  Top 0.254: MOTOR_DRIVER1.17 43.42,24.69 v43.42,25.93 | v64.5,23.39 66.6,23.39 BRUSHLESS_MOTOR_DRIVER.17
  Bottom 0.254: v43.42,25.93 49.01,25.93 51.04,23.9 63.99,23.9 v64.5,23.39
VCC  (via drill 0.35)
  Top 0.254: IC4.4 31.98,44.72 v31.73,44.47
VCP  (via drill 0.35)
  Top 0.254: MOTOR_DRIVER1.3 37.55,18.51 37.55,17.46 35.86,15.77 v34.78,15.77 | v74.13,17.28 72.76,17.28 BRUSHLESS_MOTOR_DRIVER.3
  Bottom 0.254: v34.78,15.77 72.62,15.77 v74.13,17.28
  Bottom 0.508: C11.1 36.58,17.56 v34.78,15.77
XTAL1
  Top 0.254: Q1.1 Y1.3 27.18,39.9 29.32,39.9 C13.1 R1.1 R3.2
XTAL1R
  Top 0.254: IC4.7 37.76,43.22 37.09,42.54 31.46,42.54 31.43,40.48 31.76,40.15 33.51,40.15 33.51,37.1 32.37,37.1 R3.1
XTAL2
  Top 0.254: IC4.8 40.91,42.72 40.88,42.69 40.88,39.17 38.05,36.34 30.85,36.34 R1.2 C12.1 29.32,36.34 27.18,36.34 Y1.1 Q1.2
Y_LED_POS
  Top 0.254: R6.2 LED3.A